# EAGLE design ArbotixPro-JTAGProg (EAGLE 7.2.0)
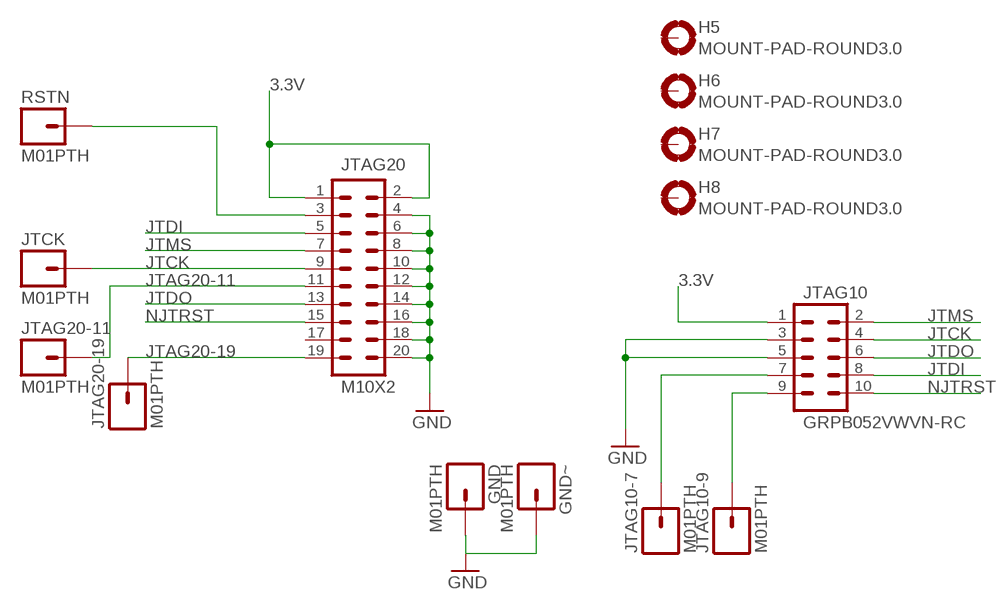
[diagram p0: schematic, sheet 1]

## Parts
GND  M01PTH  [1X01]
GND~  M01PTH  [1X01]
H5  MOUNT-PAD-ROUND3.0  [3,0-PAD]
H6  MOUNT-PAD-ROUND3.0  [3,0-PAD]
H7  MOUNT-PAD-ROUND3.0  [3,0-PAD]
H8  MOUNT-PAD-ROUND3.0  [3,0-PAD]
JTAG10  GRPB052VWVN-RC  M05X20.05_IN_PTH_SILK  [2X5_PTH_SILK_.05]
JTAG10-7  M01PTH  [1X01]
JTAG10-9  M01PTH  [1X01]
JTAG20  M10X2  [2X10]
JTAG20-11  M01PTH  [1X01]
JTAG20-19  M01PTH  [1X01]
JTCK  M01PTH  [1X01]
RSTN  M01PTH  [1X01]

## Nets
3.3V: JTAG10.1 JTAG20.1 JTAG20.2
GND: GND.1 GND~.1 JTAG10.3 JTAG10.5 JTAG20.4 JTAG20.6 JTAG20.8 JTAG20.10 JTAG20.12 JTAG20.14 JTAG20.16 JTAG20.18 JTAG20.20
JTAG20-11: JTAG20-11.1 JTAG20.11
JTAG20-19: JTAG20-19.1 JTAG20.19
JTCK: JTAG10.4 JTAG20.9 JTCK.1
JTDI: JTAG10.8 JTAG20.5
JTDO: JTAG10.6 JTAG20.13
JTMS: JTAG10.2 JTAG20.7
N$12: JTAG10-7.1 JTAG10.7
N$13: JTAG10-9.1 JTAG10.9
NJTRST: JTAG10.10 JTAG20.15
RSTN: JTAG20.3 RSTN.1
Unconnected: H5.B3,0(MOUNT) H6.B3,0(MOUNT) H7.B3,0(MOUNT) H8.B3,0(MOUNT) JTAG20.17

## Library data of the parts
GND GND~ JTAG10-7 JTAG10-9 JTAG20-11 JTAG20-19 JTCK RSTN = SparkFun-Connectors-mod1:M01: Header 1 Standard 1-pin 0.1" header. Use with straight break away headers (SKU : PRT-00116), right angle break away headers (PRT-00553), swiss pins (PRT-00743), machine pins (PRT-00117), and female headers (PRT-00115).
H5-H8 = holes:MOUNT-PAD-ROUND: MOUNTING PAD, round
JTAG10 = SparkFun-Connectors-mod1:M05X2: Header 5x2 Standard 10-pin dual row 0.1" header. Commonly used with AVR-ISP. Use with Spark Fun Electronics SKU: PRT-00778
JTAG20 = SparkFun-Connectors2:M10X2: This was SPECIALLY designed to be used with our Graphic LCD Backpack. Be sure you want to use this! It is not only staggered on each line of header holes, but IT IS ALSO offset of the center point of the top and bottom lines by 5 mil. This causes the headers to lock into place on the "standard" footprint on the LCD screen. The extra squares on the tdocu layer are there simply to reference other pins (if you were to actually populate a longer header than ten long - this is what we do with the backpacks).

## Board
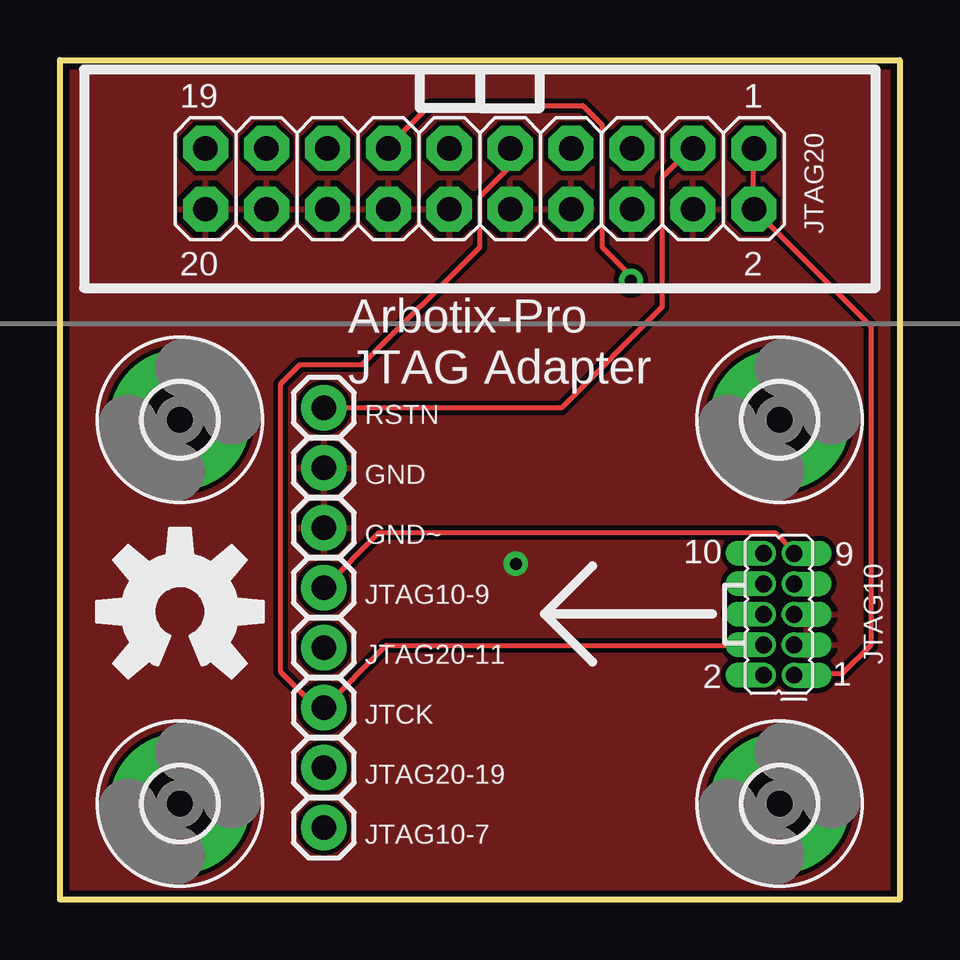
[diagram p1: board, top side]
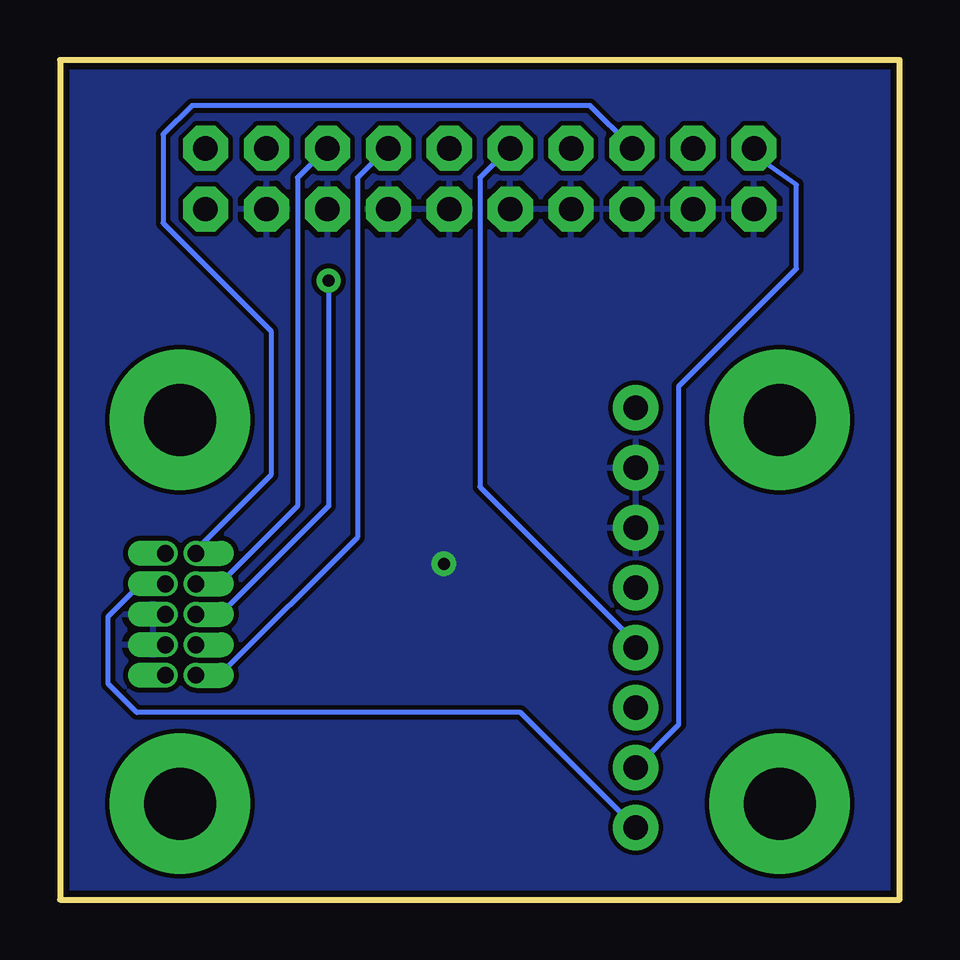
[diagram p2: board, bottom side, seen from below]

Size 35 x 35 mm. Coordinates in mm from the lower left corner, seen from the top.
Outline: 35,0 0,0 0,35 35,35 35,0
Copper layers (1*16): Top 0.035mm / dielectric 1.5mm / Bottom 0.035mm
Design rules "interbotix02mm": minimum track width 0.2mm, minimum drill 12mil, track to track 0.2mm, track to pad 0.2mm, pad to pad 0.2mm, via to via 0.2mm, smd to smd 2mil, copper to edge 10mil, drill to drill 7mil, minimum pad ring 6mil, minimum via ring 6mil, stop-mask expansion 2mil, vias tented up to drill 100mil, thermal gap 10mil

### Footprints (pad centres in the part's own frame; a part is rotated, then mirrored left to right if it is on the bottom)
1X01 = drill 1.016 pad 1.88: 1 0,0
3,0-PAD = drill 3 pad 5.842: B3,0 0,0
2X5_PTH_SILK_.05 = drill 0.7 pad 1.016 offset: 1 0,6.35; 2 1.27,6.35; 3 0,5.08; 4 1.27,5.08; 5 0,3.81; 6 1.27,3.81; 7 0,2.54; 8 1.27,2.54; 9 0,1.27; 10 1.27,1.27
2X10 = drill 1.016 pad 1.88 octagon: 1 -11.43,-1.27; 2 -11.43,1.27; 3 -8.89,-1.27; 4 -8.89,1.27; 5 -6.35,-1.27; 6 -6.35,1.27; 7 -3.81,-1.27; 8 -3.81,1.27; 9 -1.27,-1.27; 10 -1.27,1.27; 11 1.27,-1.27; 12 1.27,1.27; 13 3.81,-1.27; 14 3.81,1.27; 15 6.35,-1.27; 16 6.35,1.27; 17 8.89,-1.27; 18 8.89,1.27; 19 11.43,-1.27; 20 11.43,1.27

### Placement (x,y rotation side)
GND  11,18 0 top
GND~  11,15.5 0 top
H5  5,4 0 top
H6  30,4 0 top
H7  5,20 0 top
H8  30,20 0 top
JTAG10  30.6,15.7 180 top
JTAG10-7  11,3 0 top
JTAG10-9  11,13 0 top
JTAG20  17.5,30.05 180 top
JTAG20-11  11,10.5 0 top
JTAG20-19  11,5.5 0 top
JTCK  11,8 0 top
RSTN  11,20.5 0 top
U$1  [OSHW-LOGO-L]  5,12 0 top

### Tracks (layer width: path | path; a pad name or v marks a point on that pad's centre or on a via)
3.3V
  Top 0.2: JTAG10.1 30.6,9.4 32.6,9.4 33.8,10.6 33.8,23.9 29,28.7 JTAG20.2 28.9,28.8 28.9,31.3 JTAG20.1
GND  (via drill 0.5 pad 1.02)
  other vias: 19,14
  pour Bottom (rank 2): -0.5,35.5 35.5,35.5 35.5,-0.5 -0.5,-0.5
  pour Top (rank 2): -0.5,35.5 35.5,35.5 35.5,-0.5 -0.5,-0.5
JTAG20-11
  Bottom 0.2: JTAG20-11.1 11,10.7 17.5,17.2 17.5,30.1 16.3,31.3 JTAG20.11
JTAG20-19
  Bottom 0.2: JTAG20-19.1 9.2,7.3 9.2,21.4 4.3,26.3 4.3,29.8 6,31 6,31.3 JTAG20.19
JTCK
  Top 0.2: JTAG10.4 29.3,10.6 13.6,10.6 JTCK.1 10.7,8 9.2,9.5 9.2,21.5 10,22.3 12.6,22.3 17.5,27.2 17.5,29.3 18.7,30.5 18.7,31.3 JTAG20.9
JTDI
  Bottom 0.2: JTAG10.8 29.3,13.2 28.3,13.2 25.1,16.4 25.1,30.1 23.9,31.3 JTAG20.5
JTDO  (via drill 0.5 pad 1.02)
  Top 0.2: v23.8,25.8 23.8,26 22.6,27.2 22.6,32.3 21.8,33.1 15.4,33.1 13.7,31.4 JTAG20.13
  Bottom 0.2: v23.8,25.8 23.8,16.4 28.3,11.9 29.3,11.9 JTAG10.6
JTMS
  Bottom 0.2: JTAG10.2 29.3,9.4 28.3,9.4 22.6,15.1 22.6,30.1 21.4,31.3 JTAG20.7
N$12
  Bottom 0.2: JTAG10-7.1 15.8,7.8 31.8,7.8 33,9 33,11.8 31.7,13.1 30.6,13.1 JTAG10.7
N$13
  Top 0.2: JTAG10-9.1 13.3,15.3 29.8,15.3 30.6,14.5 JTAG10.9
NJTRST
  Bottom 0.2: JTAG10.10 29.3,14.5 29.3,14.6 26.2,17.7 26.2,23.7 30.7,28.2 30.7,31.9 29.5,33.1 12.9,33.1 11.2,31.4 JTAG20.15
RSTN
  Top 0.2: RSTN.1 20.9,20.5 25.1,24.7 25.1,30.1 26.3,31.3 JTAG20.3

### Text on the board
tPlace: 19 | 1 | 20 | 2 | 10 | 9 | 2 | 1
tNames: Arbotix-Pro / JTAG Adapter | JTAG10